# Altium project Oled.PrjPcb
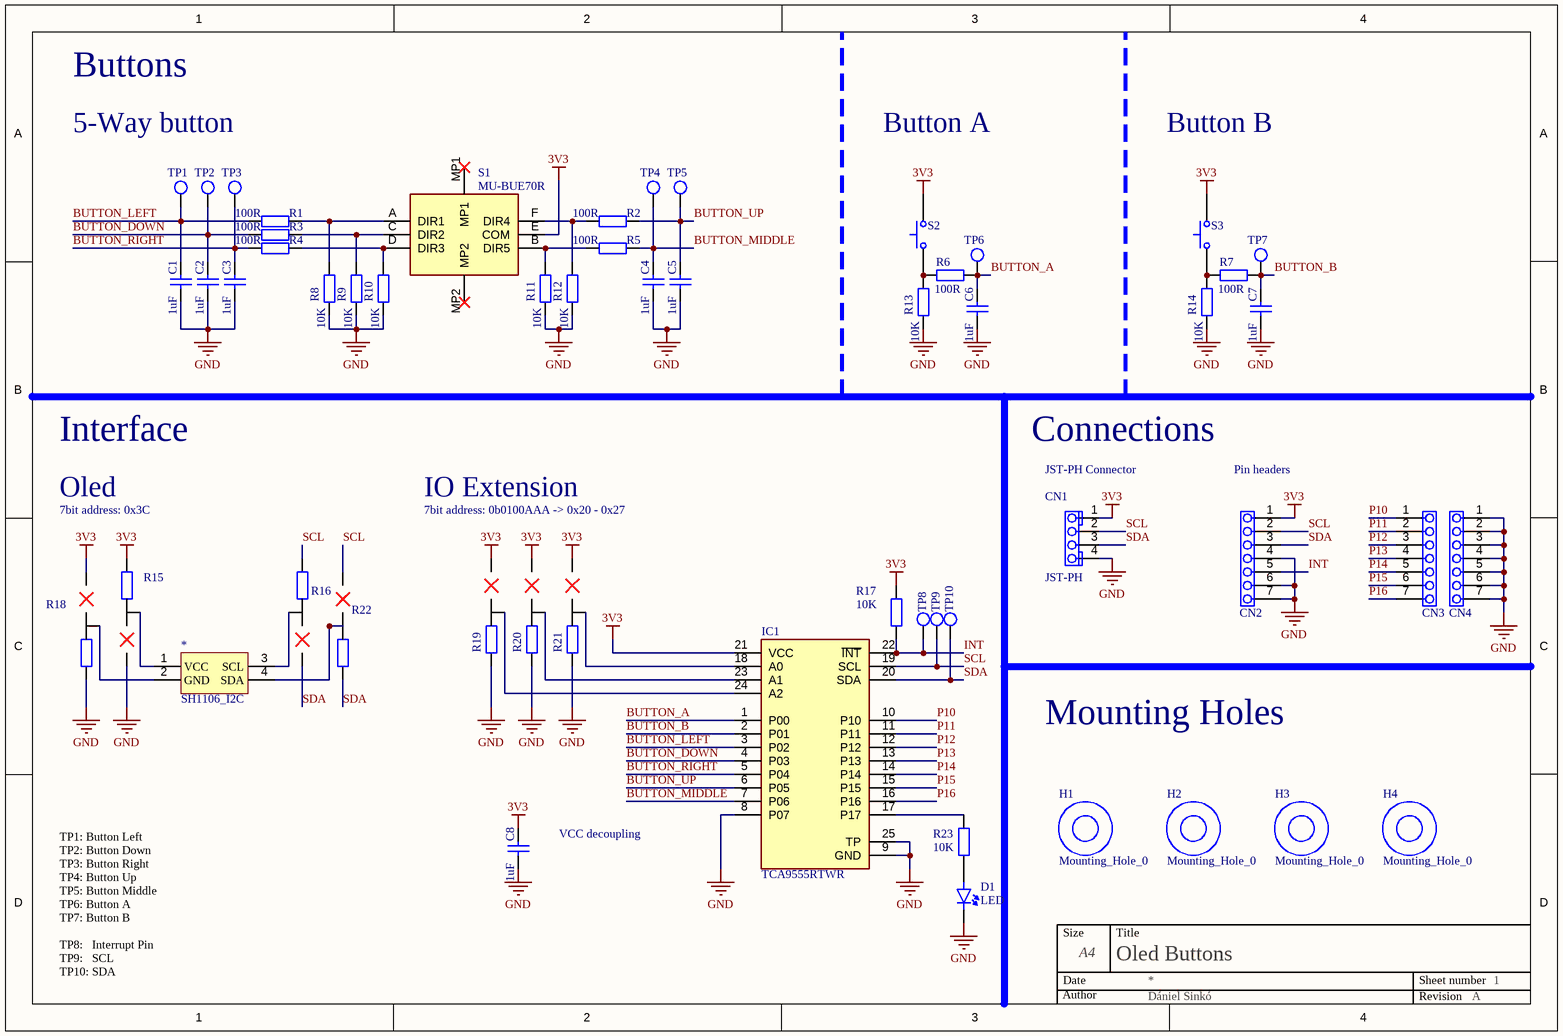
[diagram p0: Main.SchDoc]
1 sheet, 55 parts. Net scope: global (net labels, ports and power ports of the same name join across sheets).
Board file: Oled.PcbDoc

## Sheet Main.SchDoc: Oled Buttons
size A4; Author: Dániel Sinkó; Revision: A; SheetNumber: 1; SheetTotal: 1

### Parts
*  SH1106_I2C  [SH1106_I2C]
C1  1uF  [CAP0603]
C2  1uF  [CAP0603]
C3  1uF  [CAP0603]
C4  1uF  [CAP0603]
C5  1uF  [CAP0603]
C6  1uF  [CAP0603]
C7  1uF  [CAP0603]
C8  1uF  [CAP0603]
CN1  JST-PH  [JST-PH-1x4-THT-RIGHT]
CN2  Pins 1x7  [PIN-1X7]  (value not drawn)
CN3  Pins 1x7  [PIN-1X7]  (value not drawn)
CN4  Pins 1x7  [PIN-1X7]  (value not drawn)
D1  LED  [LED0603]
H1  Mounting_Hole_0  [MOUNTING_HOLE_M3_0]
H2  Mounting_Hole_0  [MOUNTING_HOLE_M3_0]
H3  Mounting_Hole_0  [MOUNTING_HOLE_M3_0]
H4  Mounting_Hole_0  [MOUNTING_HOLE_M3_0]
IC1  TCA9555RTWR  [WQFN-24]
R1  100R  [RES0603]
R2  100R  [RES0603]
R3  100R  [RES0603]
R4  100R  [RES0603]
R5  100R  [RES0603]
R6  100R  [RES0603]
R7  100R  [RES0603]
R8  10K  [RES0603]
R9  10K  [RES0603]
R10  10K  [RES0603]
R11  10K  [RES0603]
R12  10K  [RES0603]
R13  10K  [RES0603]
R14  10K  [RES0603]
R15  0R  [RES0603_SELECTION]  (value not drawn)
R16  0R  [RES0603_SELECTION]  (value not drawn)
R17  10K  [RES0603]
R18  0R  [RES0603_SELECTION]  (value not drawn)
R19  0R  [RES0603_SELECTION]  (value not drawn)
R20  0R  [RES0603_SELECTION]  (value not drawn)
R21  0R  [RES0603_SELECTION]  (value not drawn)
R22  0R  [RES0603_SELECTION]  (value not drawn)
R23  10K  [RES0603]
S1  MU-BUE70R  [MUBUE70R]
S2  Tactile switch  [TS046673BK100SMT]  (value not drawn)
S3  Tactile switch  [TS046673BK100SMT]  (value not drawn)
TP1  Test Point  [TP_PAD]  (value not drawn)
TP2  Test Point  [TP_PAD]  (value not drawn)
TP3  Test Point  [TP_PAD]  (value not drawn)
TP4  Test Point  [TP_PAD]  (value not drawn)
TP5  Test Point  [TP_PAD]  (value not drawn)
TP6  Test Point  [TP_PAD]  (value not drawn)
TP7  Test Point  [TP_PAD]  (value not drawn)
TP8  Test Point  [TP_PAD]  (value not drawn)
TP9  Test Point  [TP_PAD]  (value not drawn)
TP10  Test Point  [TP_PAD]  (value not drawn)

### Nets
3V3: C8.2 CN1.1 CN2.1 IC1.21(VCC) R15.1 R17.2 R18.3 R19.3 R20.3 R21.3 S1.E(COM) S2.4 S3.4
GND: C1.1 C2.1 C3.1 C4.1 C5.1 C6.1 C7.1 C8.1 CN1.4 CN2.4 CN2.6 CN2.7 CN4.1 CN4.2 CN4.3 CN4.4 CN4.5 CN4.6 CN4.7 D1.C IC1.8(P07) IC1.9(GND) IC1.25(TP) R8.1 R9.1 R10.1 R11.1 R12.1 R13.1 R14.1 R15.3 R18.1 R19.1 R20.1 R21.1
BUTTON_A: C6.2 IC1.1(P00) R6.2 TP6.1
BUTTON_B: C7.2 IC1.2(P01) R7.2 TP7.1
BUTTON_DOWN: C2.2 IC1.4(P03) R3.1 TP2.1
BUTTON_LEFT: C1.2 IC1.3(P02) R1.1 TP1.1
BUTTON_MIDDLE: C4.2 IC1.7(P06) R5.2 TP4.1
BUTTON_RIGHT: C3.2 IC1.5(P04) R4.1 TP3.1
BUTTON_UP: C5.2 IC1.6(P05) R2.2 TP5.1
INT: CN2.5 IC1.22(~{INT}) R17.1 TP8.1
P10: CN3.1 IC1.10(P10)
P11: CN3.2 IC1.11(P11)
P12: CN3.3 IC1.12(P12)
P13: CN3.4 IC1.13(P13)
P14: CN3.5 IC1.14(P14)
P15: CN3.6 IC1.15(P15)
P16: CN3.7 IC1.16(P16)
SCL: CN1.2 CN2.2 IC1.19(SCL) R16.1 R22.3 TP9.1
SDA: CN1.3 CN2.3 IC1.20(SDA) R16.3 R22.1 TP10.1
Net*_1: *.1(VCC) R15.2
Net*_2: *.2(GND) R18.2
Net*_3: *.3(SCL) R16.2
Net*_4: *.4(SDA) R22.2
NetD1_A: D1.A R23.1
NetIC1_17: IC1.17(P17) R23.2
NetIC1_18: IC1.18(A0) R21.2
NetIC1_23: IC1.23(A1) R20.2
NetIC1_24: IC1.24(A2) R19.2
NetR1_2: R1.2 R8.2 S1.A(DIR1)
NetR2_1: R2.1 R12.2 S1.F(DIR4)
NetR3_2: R3.2 R9.2 S1.C(DIR2)
NetR4_2: R4.2 R10.2 S1.D(DIR3)
NetR5_1: R5.1 R11.2 S1.B(DIR5)
NetR6_1: R6.1 R13.2 S2.1
NetR7_1: R7.1 R14.2 S3.1

Not connected (* = marked no-connect by the designer): S1 MP1* MP2*

### Notes on the sheet
- Buttons
- 5-Way button
- Button A
- Button B
- Interface
- Connections
- Oled
- 7bit address: 0x3C
- 7bit address: 0b0100AAA -> 0x20 - 0x27
- IO Extension
- (near CN1) JST-PH Connector
- (near CN2) Pin headers
- Mounting Holes
- (near C8) VCC decoupling
- TP1: Button Left
  TP2: Button Down
  TP3: Button Right
  TP4: Button Up
  TP5: Button Middle
  TP6: Button A
  TP7: Button B
  TP8:   Interrupt Pin
  TP9:   SCL
  TP10: SDA
- Size
- Date
- A4
- Title
- Sheet number
- Author
- Revision

### Library data of the parts
C1-C8 = 1uF: Capacitor; Voltage: 25V; Mouser Part Number: *; LCSC Part Number: C29936; Value: 1uF
CN1 = JST-PH-1x4: JST-PH-1x4 2mm; Mouser Part Number: 306-B03BPASKLFSN; LCSC Part Number: C131334
CN2-CN4 = Pin-1x7: 2.54mm; Part Class: Connector; Order Code: 855-M50-3530342; CompType: M50-3530342; Distributor: Mouser; Package: SMD 1.27mm
D1 = LED: Light Emitting Diode; Vf: 2.3V; Mouser Part Number: *; LCSC Part Number: C965800
H1-H4 = Mounting_Hole_0: Mounting hole with no connectivity.
IC1 = TCA9555RTWR: Integrated Circuit; Manufacturer_Name: Texas Instruments; Datasheet Link: http://www.ti.com/lit/gpn/tca9555; Height: 0.8mm; Manufacturer_Part_Number: TCA9555RTWR; Mouser Part Number: 595-TCA9555RTWR; Mouser Price/Stock: https://www.mouser.co.uk/ProductDetail/Texas-Instruments/TCA9555RTWR?qs=O3wcJz4o8IcrHWYYvhjJoA%3D%3D; Arrow Part Number: TCA9555RTWR; Arrow Price/Stock: https://www.arrow.com/en/products/tca9555rtwr/texas-instruments?region=nac; LCSC Part Number: C42420609
R1-R7 = 100R: Resistor; Mouser Part Number: *; LCSC Part Number: C105588; Value: 100R
R8-R14 R17 R23 = 10K: Resistor; Mouser Part Number: *; LCSC Part Number: C98220; Value: 10K
R15 R16 R18-R22 = Resistor_Selection: Resistor selection between 2 value.; Value: 0R; LCSC Part Number: C2906974
S1 = MU-BUE70R: Switch; Manufacturer_Name: Apem; Datasheet Link: https://www.mouser.se/datasheet/2/26/PCB_MU_serie-3371204.pdf; Height: 7.2mm; Manufacturer_Part_Number: MU-BUE70R; LCSC Part Number: C2858287
S2 S3 = Tactile switch: Switch (2-Pin Push) / Mouser and LCSC connection are different! Use only opposite corner pins.; Mouser Part Number: 179-TS046673BK100SMT; LCSC Part Number: C49234152